# Altium project AFE.PrjPcb
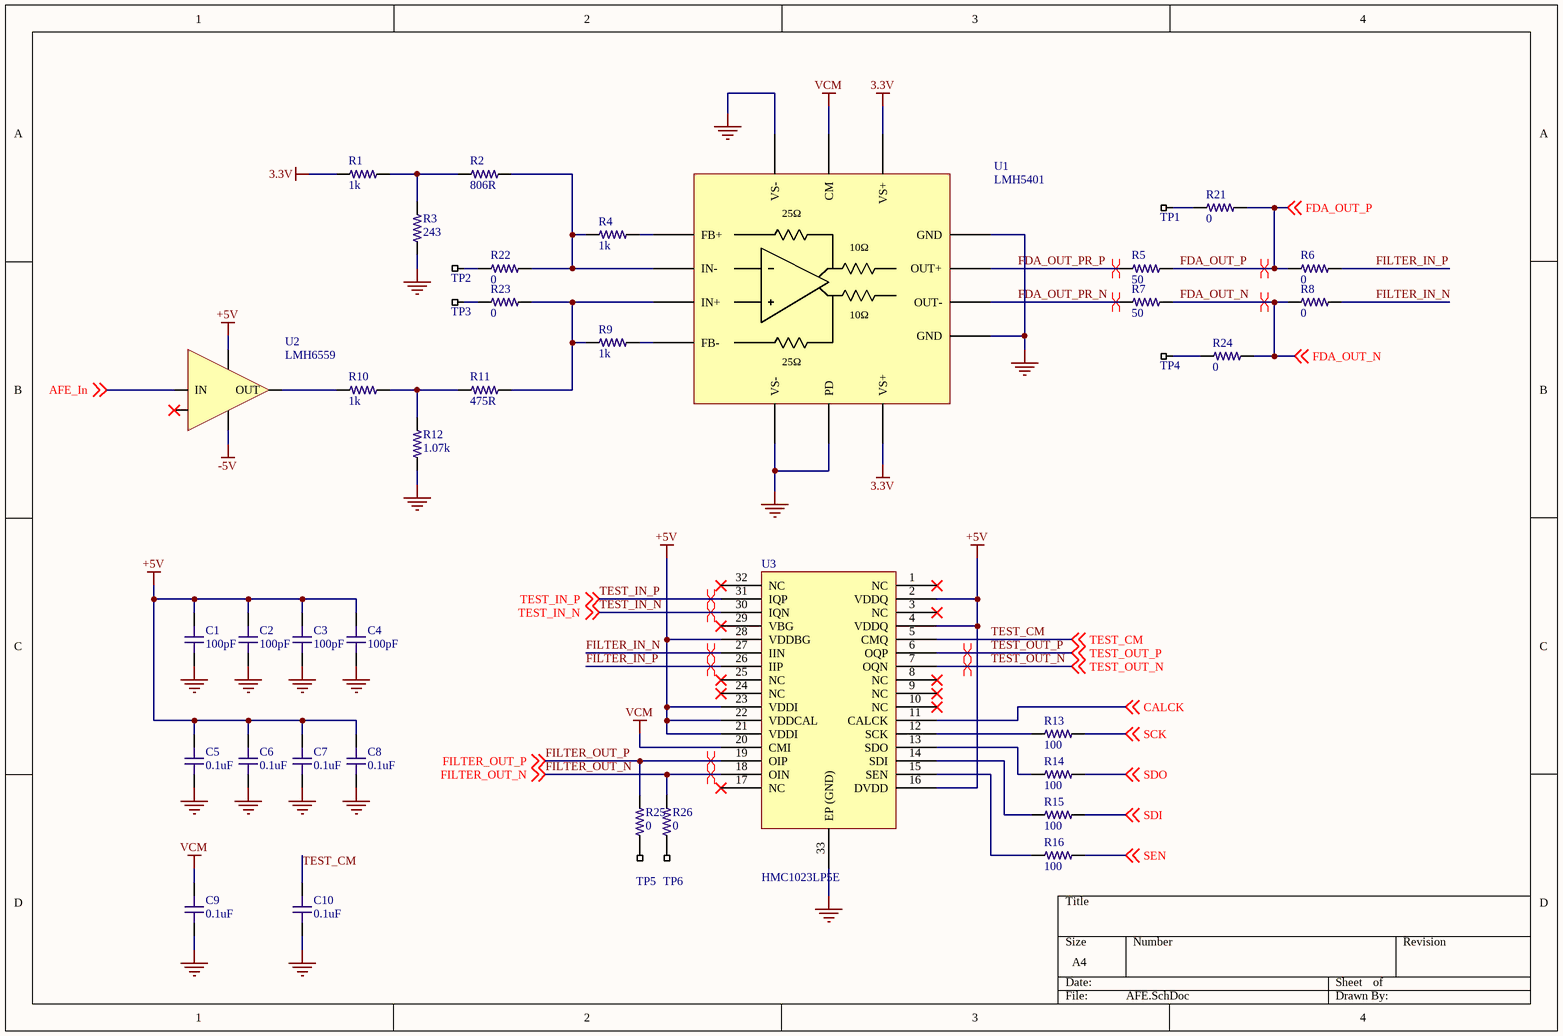
[diagram p0: AFE.SchDoc]
3 sheets, 79 parts. Net scope: global (net labels, ports and power ports of the same name join across sheets).
Board file: AFE.PcbDoc
Sheets:
  AFE.SchDoc
  Connectors.SchDoc
  Power.SchDoc

## Sheet AFE.SchDoc
size A4

### Parts
C1  value 100pF  [C0402-IPC]  (hidden comment: C0402 100pF 50V C0G)
C2  value 100pF  [C0402-IPC]  (hidden comment: C0402 100pF 50V C0G)
C3  value 100pF  [C0402-IPC]  (hidden comment: C0402 100pF 50V C0G)
C4  value 100pF  [C0402-IPC]  (hidden comment: C0402 100pF 50V C0G)
C5  value 0.1uF  [C0402-HIGH-DENSITY]  (hidden comment: GRM155R71H104KE14D)
C6  value 0.1uF  [C0402-HIGH-DENSITY]  (hidden comment: GRM155R71H104KE14D)
C7  value 0.1uF  [C0402-HIGH-DENSITY]  (hidden comment: GRM155R71H104KE14D)
C8  value 0.1uF  [C0402-HIGH-DENSITY]  (hidden comment: GRM155R71H104KE14D)
C9  value 0.1uF  [C0402-HIGH-DENSITY]  (hidden comment: GRM155R71H104KE14D)
C10  value 0.1uF  [C0402-HIGH-DENSITY]  (hidden comment: GRM155R71H104KE14D)
R1  value 1k  [R0402-HIGH-DENSITY]  (hidden comment: R0402 1k 1%)
R2  806R  [R0603-HIGH-DENSITY]
R3  value 243  [R0603-IPC]  (hidden comment: R0603 243 1%)
R4  value 1k  [R0402-HIGH-DENSITY]  (hidden comment: R0402 1k 1%)
R5  value 50  [R0402-HIGH-DENSITY]  (hidden comment: R0402 51 1%)
R6  value 0  [R0402-HIGH-DENSITY]  (hidden comment: R0402 0R)
R7  value 50  [R0402-HIGH-DENSITY]  (hidden comment: R0402 51 1%)
R8  value 0  [R0402-HIGH-DENSITY]  (hidden comment: R0402 0R)
R9  value 1k  [R0402-HIGH-DENSITY]  (hidden comment: R0402 1k 1%)
R10  value 1k  [R0402-HIGH-DENSITY]  (hidden comment: R0402 1k 1%)
R11  475R  [R0402-HIGH-DENSITY]
R12  1.07k  [R0603-HIGH-DENSITY]
R13  value 100  [R0402-HIGH-DENSITY]  (hidden comment: R0402 100R 1%)
R14  value 100  [R0402-HIGH-DENSITY]  (hidden comment: R0402 100R 1%)
R15  value 100  [R0402-HIGH-DENSITY]  (hidden comment: R0402 100R 1%)
R16  value 100  [R0402-HIGH-DENSITY]  (hidden comment: R0402 100R 1%)
R21  value 0  [R0402-HIGH-DENSITY]  (hidden comment: R0402 0R)
R22  value 0  [R0402-HIGH-DENSITY]  (hidden comment: R0402 0R)
R23  value 0  [R0402-HIGH-DENSITY]  (hidden comment: R0402 0R)
R24  value 0  [R0402-HIGH-DENSITY]  (hidden comment: R0402 0R)
R25  value 0  [R0402-HIGH-DENSITY]  (hidden comment: R0402 0R)
R26  value 0  [R0402-HIGH-DENSITY]  (hidden comment: R0402 0R)
TP1  Testpoint_SMT  [TESTPOINT_SMT]  (value not drawn)  (no BOM)
TP2  Testpoint_SMT  [TESTPOINT_SMT]  (value not drawn)  (no BOM)
TP3  Testpoint_SMT  [TESTPOINT_SMT]  (value not drawn)  (no BOM)
TP4  Testpoint_SMT  [TESTPOINT_SMT]  (value not drawn)  (no BOM)
TP5  Testpoint_SMT  [TESTPOINT_SMT]  (value not drawn)  (no BOM)
TP6  Testpoint_SMT  [TESTPOINT_SMT]  (value not drawn)  (no BOM)
U1  LMH5401  [LMH5401]
U2  LMH6559  [LMH6559]
U3  HMC1023LP5E  [HMC1023]

### Nets
3.3V: R1.1 U1.1(VS+) U1.10(VS+)
+5V: C1.2 C2.2 C3.2 C4.2 C5.2 C6.2 C7.2 C8.2 U2.5(V+) U3.2(VDDQ) U3.4(VDDQ) U3.16(DVDD) U3.21(VDDI) U3.22(VDDCAL) U3.23(VDDI) U3.28(VDDBG)
-5V: U2.2(V-)
GND: C1.1 C2.1 C3.1 C4.1 C5.1 C6.1 C7.1 C8.1 C9.1 C10.1 R3.1 R12.1 U1.3(VS-) U1.8(VS-) U1.9(PD) U1.11(GND) U1.14(GND) U3.33(EP_(GND))
VCM: C9.2 U1.2(CM) U3.20(CMI)
AFE_In: U2.4(IN) ; off-sheet AFE_In
CALCK: U3.11(CALCK) ; off-sheet CALCK
FDA_OUT_N: R7.2 R8.1 R24.2 ; off-sheet FDA_OUT_N
FDA_OUT_P: R5.2 R6.1 R21.2 ; off-sheet FDA_OUT_P
FDA_OUT_PR_N: R7.1 U1.12(OUT-)
FDA_OUT_PR_P: R5.1 U1.13(OUT+)
FILTER_IN_N: R8.2 U3.27(IIN)
FILTER_IN_P: R6.2 U3.26(IIP)
FILTER_OUT_N: R26.2 U3.18(OIN) ; off-sheet FILTER_OUT_N  [project net AFE_Out4_N]
FILTER_OUT_P: R25.2 U3.19(OIP) ; off-sheet FILTER_OUT_P  [project net AFE_Out4_P]
SCK: R13.2 ; off-sheet SCK
SDI: R15.2 ; off-sheet SDI
SDO: R14.2 ; off-sheet SDO
SEN: R16.2 ; off-sheet SEN
TEST_CM: C10.2 U3.5(CMQ) ; off-sheet TEST_CM
TEST_IN_N: U3.30(IQN) ; off-sheet TEST_IN_N
TEST_IN_P: U3.31(IQP) ; off-sheet TEST_IN_P
TEST_OUT_N: U3.7(OQN) ; off-sheet TEST_OUT_N
TEST_OUT_P: U3.6(OQP) ; off-sheet TEST_OUT_P
NetR1_2: R1.2 R2.1 R3.2
NetR2_2: R2.2 R4.1 R22.2 U1.5(IN-)
NetR4_2: R4.2 U1.4(FB+)
NetR9_1: R9.1 R11.2 R23.2 U1.6(IN+)
NetR9_2: R9.2 U1.7(FB-)
NetR10_1: R10.1 U2.1(OUT)
NetR10_2: R10.2 R11.1 R12.2
NetR13_1: R13.1 U3.12(SCK)
NetR14_1: R14.1 U3.13(SDO)
NetR15_1: R15.1 U3.14(SDI)
NetR16_1: R16.1 U3.15(SEN)
NetR21_1: R21.1 TP1.1
NetR22_1: R22.1 TP2.1
NetR23_1: R23.1 TP3.1
NetR24_1: R24.1 TP4.1
NetR25_1: R25.1 TP5.1
NetR26_1: R26.1 TP6.1

Not connected (* = marked no-connect by the designer): U2 3(NC)*; U3 1(NC)* 3(NC)* 8(NC)* 9(NC)* 10(NC)* 17(NC)* 24(NC)* 25(NC)* 29(VBG)* 32(NC)*

### Layout directives
differential pair: AFE_Out4_N, AFE_Out4_P, FDA_OUT_N, FDA_OUT_P, FDA_OUT_PR_N, FDA_OUT_PR_P, FILTER_IN_N, FILTER_IN_P, TEST_IN_N, TEST_IN_P, TEST_OUT_N, TEST_OUT_P

### Notes on the sheet
- (in symbol LMH5401) 25Ω; 10Ω

### Library data of the parts
C1-C4 = C0402 100pF 50V C0G: Chip Capacitor, 0402, 100p, 1%, 50V, C0G; Max. Voltage: 50V; EIA Code: C0G; Supplier 1: Digi-Key; Supplier Part Number 1: 490-7753-1-ND
C5-C10 = C0402 0.1uF 50V X7R: Chip Capacitor, 0402, 0.10uF, 50V, X7R; Supplier 1: Digi-Key; Supplier Part Number 1: 490-10700-1-ND
R1 R4 R9 R10 = R0402 1k 1%: Chip Resistor, 0402, 1k ohms, 1%, 1/16 W; Supplier 1: Digi-Key; Supplier Part Number 1: 311-1.00KLRCT-ND
R2 = 806R 0603 0.5% 1/10W: RES 806 OHM 0.5% 1/10W 0603; Manufacturer: Stackpole Electronics; Manufacturer Part Number: RNCF0603DTE806R; Power Rating: 63mW; Supplier 1: Digi-Key; RoHS: Yes; Category: Chip SMD Resistors; Stock 1: 7286; Pricing 1: 1=0.13000, 10=0.11000, 100=0.04300, 1000=0.01800, 2500=0.01650 (USD); Mount: Surface Mount; Case/Package: 0603; Min Operating Temperature: -55°C; Max Operating Temperature: 155°C; Resistance: 806R; Tolerance: 0.5%; Packaging: Tape and Reel; RoHS Compliant: Yes; ComponentLink1URL: https://www.seielect.com/catalog/sei-rncf.pdf?src-supplier=Digi-Key; ComponentLink1Description: https://www.seielect.com/catalog/sei-rncf.pdf?src-supplier=Digi-Key; Supplier Part Number 1: RNCF0603DTE806RCT-ND
R3 = R0603 243 1%: RES SMD 243 OHM 1% 1/10W 0603; Temperature Coefficient: ±100ppm/°C; Tolerance: ±1%; Features: Automotive AEC-Q200; Operating Temperature: -55°C ~ 155°C; Supplier 1: Digi-Key; Supplier Part Number 1: RMCF0603FT243RCT-ND
R5 R7 = R0402 51 1%: Chip Resistor, 0402, 50 ohms, 1%, 1/10 W
R6 R8 R21-R26 = R0402 0R: Chip Resistor, 0402, 0 ohm jumper; Supplier 1: Digi-Key; Supplier Part Number 1: 311-0.0JRCT-ND
R11 = 475R 0402 1% 1/5W: RES SMD 475 OHM 1% 1/5W 0402; Manufacturer: Vishay Dale; Manufacturer Part Number: CRCW0402475RFKEDHP; Max Power Dissipation: 125mW; Temperature Coefficient: 100ppm/°C; Supplier 1: Digi-Key; RoHS: Yes; Category: Chip SMD Resistors; Stock 1: 9500; Pricing 1: 1=0.14000, 10=0.12600, 100=0.04840, 1000=0.02130, 2500=0.01839, 5000=0.01646 (USD); Case/Package: 0402; Contact Plating: Tin; Min Operating Temperature: -55°C; Max Operating Temperature: 155°C; Resistance: 475R; Tolerance: 1%; Package Quantity: 10000; Packaging: Tape and Reel; Resistor Type: Thick Film; Number of Terminations: 2; Features: Automotive AEC-Q200; Series: CRCW-HP; Length: 0.039inch; Width: 0.02inch; Height: 0.016inch; Radiation Hardening: No; Lead Free: Lead Free; RoHS Compliant: Yes; ComponentLink1URL: https://datasheet.ciiva.com/8898/crcwhpe3-8898762.pdf?src-supplier=Avnet; ComponentLink1Description: https://datasheet.ciiva.com/8898/crcwhpe3-8898762.pdf?src-supplier=Avnet; ComponentLink2URL: https://datasheet.ciiva.com/2573/crcwhpe3-2573100.pdf?src-supplier=Digi-Key; ComponentLink2Description: https://datasheet.ciiva.com/2573/crcwhpe3-2573100.pdf?src-supplier=Digi-Key; Supplier Part Number 1: 541-CRCW0402475RFKEDHPCT-ND
R12 = 1.07k 0603 1% 1/10W: RES SMD 1.07K OHM 1% 1/10W 0603; Manufacturer: Stackpole Electronics; Manufacturer Part Number: RMCF0603FT1K07; Resistance: 1.07kR; Max Power Dissipation: 100mW; Temperature Coefficient: 100ppm/°C; Supplier 1: Digi-Key; RoHS: Yes; Category: Chip SMD Resistors; Stock 1: 16341; Pricing 1: 1=0.10000, 10=0.01600, 100=0.00650, 1000=0.00292, 2500=0.00253 (USD); Mount: Surface Mount; Case/Package: 0603; Case Code (Metric): 1608; Case Code (Imperial): 0603; Contact Plating: Tin,Matte; Min Operating Temperature: -55°C; Max Operating Temperature: 155°C; Packaging: Tape and Reel; Tolerance: 1%; Resistor Type: Thick Film; Number of Terminations: 2; Features: Automotive AEC-Q200; Series: RMCF; Length: 0.061inch; Width: 0.031inch; Height: 0.022inch; Radiation Hardening: No; Lead Free: Lead Free; RoHS Compliant: Yes; ComponentLink1URL: https://www.seielect.com/catalog/SEI-RMCF_RMCP.pdf?src-supplier=Avnet; ComponentLink1Description: https://www.seielect.com/catalog/SEI-RMCF_RMCP.pdf?src-supplier=Avnet; ComponentLink2URL: https://www.seielect.com/Catalog/SEI-RMCF_RMCP.pdf?src-supplier=Digi-Key; ComponentLink2Description: https://www.seielect.com/Catalog/SEI-RMCF_RMCP.pdf?src-supplier=Digi-Key; ComponentLink3URL: https://www.seielect.com/catalog/SEI-Packaging.pdf?src-supplier=Digi-Key; ComponentLink3Description: https://www.seielect.com/catalog/SEI-Packaging.pdf?src-supplier=Digi-Key; Supplier Part Number 1: RMCF0603FT1K07CT-ND
R13-R16 = R0402 100R 1%: Chip Resistor, 0402, 100 ohms, 1%, 1/16 W; Supplier 1: Digi-Key; Supplier Part Number 1: 311-100LRCT-ND
TP1-TP6 = Testpoint_SMT: SMT Test Point
U1 = LMH5401: TEXAS INSTRUMENTS - LMH5401IRMST - DIFF AMP, 6.2GHZ, 17.5KV/US, UQFN-14; Min Supply Voltage: 3.15V; Max Supply Voltage: 5.25V; Min Dual Supply Voltage: 1.575V; Max Dual Supply Voltage: 2.625V; Number of Circuits: 1; Slew Rate: 17500V/µs; Gain Bandwidth Product: 8GHz; -3db Bandwidth: 1.2GHz; Operating Supply Current: 55mA; Output Current per Channel: 50mA; Frequency: 2GHz; Gain: 6dB; Operating Supply Voltage: 5V; Supplier 1: Digi-Key; Manufacturer: Texas Instruments; Manufacturer Part Number: LMH5401IRMST; RoHS: Yes; Category: Amplifiers - Op Amps, Buffer, Instrumentation; Stock 1: 1716; Pricing 1: 1=17.26000, 10=15.86500, 25=15.20760, 100=12.74150 (USD); Mount: Surface Mount; Number of Pins: 14; Weight: 0.000353oz; Min Operating Temperature: -40°C; Max Operating Temperature: 85°C; Packaging: Tape and Reel; Number of Amplifiers: 1; Bandwidth: 8GHz; Number of Channels: 1; Package Quantity: 250; REACH SVHC: No SVHC; Lead Free: Lead Free; RoHS Compliant: Yes; ComponentLink1URL: https://datasheet.ciiva.com/48505/lmh5401-48505045.pdf?src-supplier=Avnet; ComponentLink1Description: https://datasheet.ciiva.com/48505/lmh5401-48505045.pdf?src-supplier=Avnet; Supplier Part Number 1: 296-38513-1-ND
U2 = LMH6559: OP Amp Buffer Single GP 10V 5-Pin SOT-23 T/R; Manufacturer: TI National Semiconductor; Manufacturer Part Number: LMH6559MF/NOPB; Min Supply Voltage: 3V; Voltage Gain: 59.98dB; Output Current: 75mA; Number of Channels: 1; Slew Rate: 4580V/µs; Nominal Supply Current: 10mA; Operating Supply Voltage: 5V; Input Bias Current: 3uA; Input Offset Voltage (Vos): 3mV; Output Current per Channel: 74mA; Min Dual Supply Voltage: 1.5V; Power Supply Rejection Ratio (PSRR): 44dB; -3db Bandwidth: 1.75GHz; Supplier 1: Digi-Key; RoHS: No; Category: Amplifiers - Op Amps, Buffer, Instrumentation; Stock 1: 2784; Pricing 1: 1=2.89000, 10=2.59800, 25=2.45640, 100=2.01980, 250=1.81240, 500=1.74688 (USD); Mount: Surface Mount; Case/Package: SOT-23; Number of Pins: 5; Min Operating Temperature: -40°C; Max Operating Temperature: 85°C; Max Supply Voltage: 10V; Packaging: Tape and Reel; Package Quantity: 1000; Number of Circuits: 1; Supply Current: 10mA; Amplifier Type: BUFFER; Number of Elements: 1; Series: -; Number of Amplifiers: 1; Bandwidth: 1.75GHz; Termination: SMD/SMT; Length: 2.92mm; Width: 1.6mm; Height: 1.02mm; Radiation Hardening: No; Lead Free: Lead Free; REACH SVHC: No SVHC; ComponentLink1URL: https://datasheet.ciiva.com/15130/getdatasheetpartid-68437-15130143.pdf?src-supplier=Verical; ComponentLink1Description: https://datasheet.ciiva.com/15130/getdatasheetpartid-68437-15130143.pdf?src-supplier=Verical; ComponentLink2URL: https://datasheet.ciiva.com/2975/lmh6559-2975204.pdf?src-supplier=Avnet; ComponentLink2Description: https://datasheet.ciiva.com/2975/lmh6559-2975204.pdf?src-supplier=Avnet; ComponentLink3URL: https://datasheet.ciiva.com/2975/lmh6559-2975205.pdf?src-supplier=Avnet; ComponentLink3Description: https://datasheet.ciiva.com/2975/lmh6559-2975205.pdf?src-supplier=Avnet; ComponentLink4URL: https://datasheet.ciiva.com/6630/lmh6559-6630632.pdf?src-supplier=Digi-Key; ComponentLink4Description: https://datasheet.ciiva.com/6630/lmh6559-6630632.pdf?src-supplier=Digi-Key; ComponentLink5URL: https://datasheet.ciiva.com/6630/lmh6559-6630633.pdf?src-supplier=Digi-Key; ComponentLink5Description: https://datasheet.ciiva.com/6630/lmh6559-6630633.pdf?src-supplier=Digi-Key; ComponentLink6URL: https://datasheet.ciiva.com/6630/lmh6559-6630634.pdf?src-supplier=Digi-Key; ComponentLink6Description: https://datasheet.ciiva.com/6630/lmh6559-6630634.pdf?src-supplier=Digi-Key; ComponentLink7URL: https://datasheet.ciiva.com/4756/lmh6559-4756997.pdf?src-supplier=Mouser; ComponentLink7Description: https://datasheet.ciiva.com/4756/lmh6559-4756997.pdf?src-supplier=Mouser; ComponentLink8URL: https://datasheet.ciiva.com/14094/lmh6559-eng-tds-14094141.pdf?src-supplier=Distrelec; ComponentLink8Description: https://datasheet.ciiva.com/14094/lmh6559-eng-tds-14094141.pdf?src-supplier=Distrelec; ComponentLink9URL: https://datasheet.ciiva.com/26223/lmh6559-26223561.pdf?src-supplier=Avnet+Europe; ComponentLink9Description: https://datasheet.ciiva.com/26223/lmh6559-26223561.pdf?src-supplier=Avnet+Europe; Supplier Part Number 1: LMH6559MF/NOPBCT-ND
U3 = HMC1023LP5E: Active Filter Dual Low Pass Filter 6th Order 72MHz 32-Pin QFN Bulk; Manufacturer: Analog Devices; Operating Supply Voltage: 5V; Min Supply Voltage: 4.75V; Max Supply Voltage: 5.25V; Frequency: 100MHz; Number of Channels: 2; Supplier 1: Digi-Key; Manufacturer Part Number: HMC1023LP5E; RoHS: Yes; Category: Integrated Circuits (ICs); Stock 1: 38; Pricing 1: 1=25.14000, 10=24.35000, 25=23.56480, 50=22.77960, 100=21.99400, 250=20.89432 (USD); Mount: Surface Mount; Case/Package: QFN; Number of Pins: 32; Weight: 0.006653oz; Contact Plating: Tin,Matte; Min Operating Temperature: -40°C; Max Operating Temperature: 85°C; Packaging: Cut Tape; Package Quantity: 1; Bandwidth: 72MHz; Number of Circuits: 2; Max Frequency: 72MHz; Length: 0.197inch; Width: 0.197inch; Height: 0.039inch; REACH SVHC: Unknown; Lead Free: Contains Lead; RoHS Compliant: Yes; ComponentLink1URL: https://datasheet.ciiva.com/29361/hmc1023lp5-29361744.pdf?src-supplier=Digi-Key; ComponentLink1Description: https://datasheet.ciiva.com/29361/hmc1023lp5-29361744.pdf?src-supplier=Digi-Key; Supplier Part Number 1: 1127-1662-ND

## Sheet Connectors.SchDoc
size A4
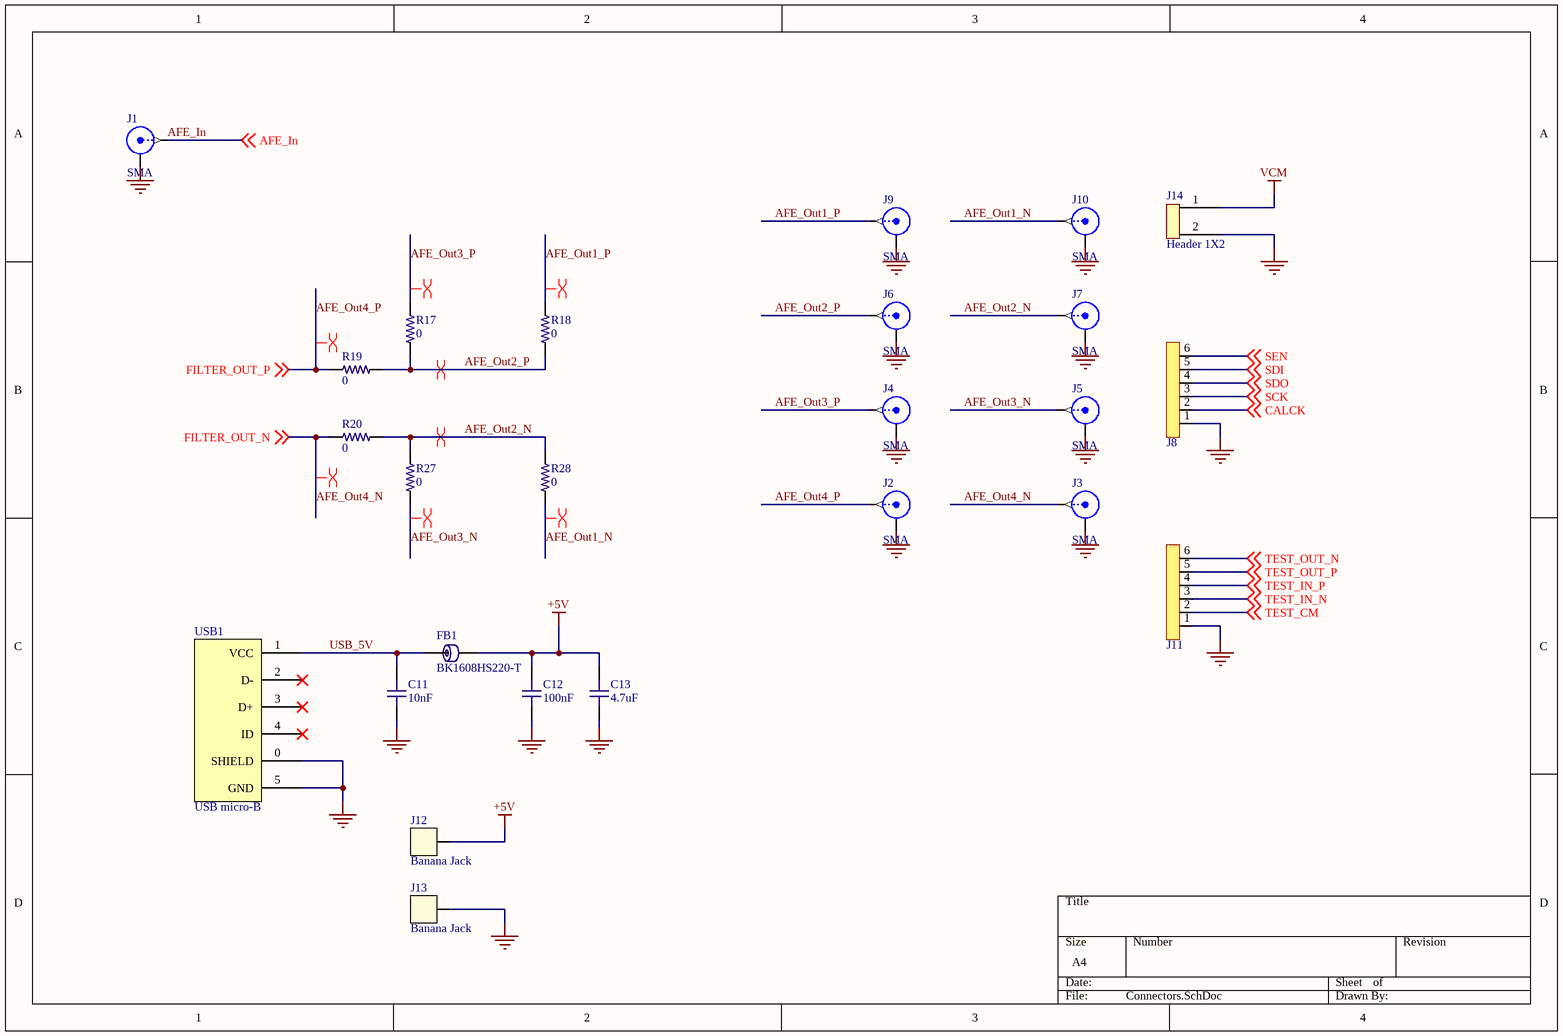
[diagram p1: Connectors.SchDoc]

### Parts
C11  value 10nF  [C0402-IPC]  (hidden comment: C0402 10nF 16V X7R)
C12  value 100nF  [C0402-IPC]  (hidden comment: C0402 100nF 16V X7R)
C13  value 4.7uF  [C0603-HIGH-DENSITY]  (hidden comment: 4.7uF, 25V, X5R, 0603)
FB1  BK1608HS220-T  [L0603]
J1  SMA  [SMA Edge Launch (Horizontal)]
J2  SMA  [SMA Edge Launch (Horizontal)]
J3  SMA  [SMA Edge Launch (Horizontal)]
J4  SMA  [SMA Edge Launch (Horizontal)]
J5  SMA  [SMA Edge Launch (Horizontal)]
J6  SMA  [SMA Edge Launch (Horizontal)]
J7  SMA  [SMA Edge Launch (Horizontal)]
J8  100 mil hdr 6 pos  [100MIL HDR 6 POS]  (value not drawn)
J9  SMA  [SMA Edge Launch (Horizontal)]
J10  SMA  [SMA Edge Launch (Horizontal)]
J11  100 mil hdr 6 pos  [100MIL HDR 6 POS]  (value not drawn)
J12  Banana Jack  [Banana Jack]
J13  Banana Jack  [Banana Jack]
J14  Header 1X2  [Header 1x2 TH Pitch 2.54mm]
R17  value 0  [R0603-IPC]  (hidden comment: R0603 0)
R18  value 0  [R0603-IPC]  (hidden comment: R0603 0)
R19  value 0  [R0603-IPC]  (hidden comment: R0603 0)
R20  value 0  [R0603-IPC]  (hidden comment: R0603 0)
R27  value 0  [R0603-IPC]  (hidden comment: R0603 0)
R28  value 0  [R0603-IPC]  (hidden comment: R0603 0)
USB1  USB micro-B  [USB-MicroB]

### Nets
+5V: C12.2 C13.2 FB1.2 J12.1
GND: C11.1 C12.1 C13.1 J1.2(Y) J2.2(Y) J3.2(Y) J4.2(Y) J5.2(Y) J6.2(Y) J7.2(Y) J8.1 J9.2(Y) J10.2(Y) J11.1 J13.1 J14.2 USB1.0(SHIELD) USB1.5(GND)
VCM: J14.1
AFE_In: J1.1(X) ; off-sheet AFE_In
AFE_Out1_N: J10.1(X) R28.1
AFE_Out1_P: J9.1(X) R18.2
AFE_Out2_N: J7.1(X) R20.2 R27.2 R28.2
AFE_Out2_P: J6.1(X) R17.1 R18.1 R19.2
AFE_Out3_N: J5.1(X) R27.1
AFE_Out3_P: J4.1(X) R17.2
AFE_Out4_N: J3.1(X) R20.1 ; off-sheet FILTER_OUT_N  [also labelled FILTER_OUT_N]
AFE_Out4_P: J2.1(X) R19.1 ; off-sheet FILTER_OUT_P  [also labelled FILTER_OUT_P]
CALCK: J8.2 ; off-sheet CALCK
SCK: J8.3 ; off-sheet SCK
SDI: J8.5 ; off-sheet SDI
SDO: J8.4 ; off-sheet SDO
SEN: J8.6 ; off-sheet SEN
TEST_CM: J11.2 ; off-sheet TEST_CM
TEST_IN_N: J11.3 ; off-sheet TEST_IN_N
TEST_IN_P: J11.4 ; off-sheet TEST_IN_P
TEST_OUT_N: J11.6 ; off-sheet TEST_OUT_N
TEST_OUT_P: J11.5 ; off-sheet TEST_OUT_P
USB_5V: C11.2 FB1.1 USB1.1(VCC)

Not connected (* = marked no-connect by the designer): USB1 2(D-)* 3(D+)* 4(ID)*

### Layout directives
differential pair: AFE_Out1_N, AFE_Out1_P, AFE_Out2_N, AFE_Out2_P, AFE_Out3_N, AFE_Out3_P, AFE_Out4_N, AFE_Out4_P

### Library data of the parts
C11 = C0402 10nF 16V X7R: Chip Capacitor, 0402, 10nF, 16V, X7R; EIA Code: X5R; Max. Voltage: 16V; Supplier 1: Digi-Key; Supplier Part Number 1: 490-1313-1-ND
C12 = C0402 100nF 16V X7R: Chip Capacitor, 0402, 100nF, 16V, X7R; EIA Code: X5R; Max. Voltage: 16V; Supplier 1: Digi-Key; Supplier Part Number 1: 490-6328-1-ND
C13 = C0603 4.7uF 25V X5R: Chip Capacitor, 0603, 4.7uF, 25V, X5R; EIA Code: X5R; Max. Voltage: 25V; Supplier 1: Digi-Key; Supplier 2: Mouser; Supplier 3: LCSC; Supplier Part Number 1: 490-7203-1-ND; Supplier Part Number 2: 81-GRM188R61E475KE1D; Supplier Part Number 3: C90057
FB1 = BK1608HS220-T: Ferrite Beads Multi-Layer 22Ohm 25% 100MHz 1.5A 0.05Ohm DCR 0603 T/R; Manufacturer: Taiyo Yuden; Impedance: 22R; DC Resistance (DCR): 50mR; Number of Lines: 1; Shielding: Shielded; Supplier 1: Digi-Key; Manufacturer Part Number: BK1608HS220-T; RoHS: Yes; Category: Ferrite Beads and Chips; Stock 1: 23669; Pricing 1: 1=0.10000, 10=0.07200, 25=0.06560, 50=0.05900, 100=0.04320, 250=0.03144, 500=0.02882, 1000=0.02489 (USD); Mount: Surface Mount; Case/Package: 0603; Number of Pins: 2; Core Material: Ferrite; Case Code (Metric): 1608; Case Code (Imperial): 0603; Min Operating Temperature: -55°C; Max Operating Temperature: 125°C; Package Quantity: 1; Packaging: Tape and Reel; Tolerance: 25%; Max DC Current: 1.5A; Termination: SMD/SMT; Test Frequency: 100MHz; Resistance: 50mR; Max Current Rating: 1.5A; Series: BK; Frequency: 100MHz; Length: 0.063inch; Width: 0.031inch; Height: 0.037inch; Depth: 0.95mm; RoHS Compliant: Yes; REACH SVHC: No SVHC; Lead Free: Lead Free; Halogen Free: Halogen Free; ComponentLink1URL: https://datasheet.ciiva.com/1011/bk1608hs220-t-ss-1011861.pdf?src-supplier=Digi-Key; ComponentLink1Description: https://datasheet.ciiva.com/1011/bk1608hs220-t-ss-1011861.pdf?src-supplier=Digi-Key; ComponentLink2URL: https://datasheet.ciiva.com/1011/mlci07-e-1011862.pdf?src-supplier=Digi-Key; ComponentLink2Description: https://datasheet.ciiva.com/1011/mlci07-e-1011862.pdf?src-supplier=Digi-Key; ComponentLink3URL: https://datasheet.ciiva.com/1011/mlci07-e-1011863.pdf?src-supplier=Digi-Key; ComponentLink3Description: https://datasheet.ciiva.com/1011/mlci07-e-1011863.pdf?src-supplier=Digi-Key; ComponentLink4URL: https://datasheet.ciiva.com/5821/mlci07-e-5821271.pdf?src-supplier=Farnell; ComponentLink4Description: https://datasheet.ciiva.com/5821/mlci07-e-5821271.pdf?src-supplier=Farnell; ComponentLink5URL: https://datasheet.ciiva.com/7620/1734576-7620028.pdf?src-supplier=Element14; ComponentLink5Description: https://datasheet.ciiva.com/7620/1734576-7620028.pdf?src-supplier=Element14; Supplier Part Number 1: 587-1869-1-ND
J1-J7 J9 J10 = SMA: SMA Connector; Supplier 1: Digi-Key; Supplier Part Number 1: A97594-ND
J8 J11 = 100 mil hdr 6 pos: Header, 100 mil, 6pos, tin; Supplier 1: Digi-Key; Supplier Part Number 1: A31116-ND
J12 J13 = Banana Jack: JACK NON-INSULATED .350"; Supplier 1: Digi-Key; Supplier Part Number 1: 36-575-8-ND
R17-R20 R27 R28 = R0603 0: RES SMD 0 OHM JUMPER 1/10W 0603; Supplier 1: Digi-Key; Supplier Part Number 1: RMCF0603ZT0R00CT-ND
USB1 = USB micro-B: CONN RCPT USB TYPE B 3A; Manufacturer Part Number: 629105150521; Manufacturer: Wurth Electronics Inc.; Supplier 1: Digi-Key; Supplier Part Number 1: 609-4616-1-ND

## Sheet Power.SchDoc
size A4
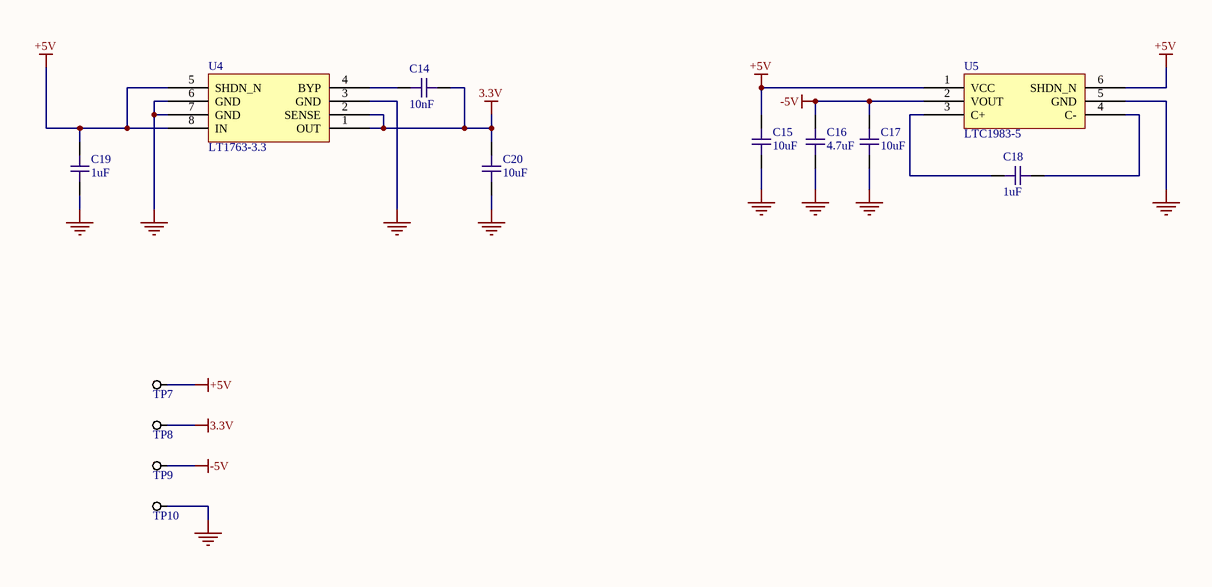
[diagram p2: Power.SchDoc]

### Parts
C14  value 10nF  [C0402-IPC]  (hidden comment: C0402 10nF 16V X7R)
C15  value 10uF  [C0402-HIGH-DENSITY]  (hidden comment: C0402 10uF 10V)
C16  value 4.7uF  [C0603-HIGH-DENSITY]  (hidden comment: 4.7uF, 25V, X5R, 0603)
C17  value 10uF  [C0402-HIGH-DENSITY]  (hidden comment: C0402 10uF 10V)
C18  1uF  [C0603-HIGH-DENSITY]
C19  1uF  [C0603-HIGH-DENSITY]
C20  value 10uF  [C0402-HIGH-DENSITY]  (hidden comment: C0402 10uF 10V)
TP7  Testpoint_TH  [Testpoint_TH]  (value not drawn)
TP8  Testpoint_TH  [Testpoint_TH]  (value not drawn)
TP9  Testpoint_TH  [Testpoint_TH]  (value not drawn)
TP10  Testpoint_TH  [Testpoint_TH]  (value not drawn)
U4  LT1763-3.3  [LT1763-3.3]
U5  LTC1983-5  [LTC1983-5]

### Nets
3.3V: C14.2 C20.2 TP8.1 U4.1(OUT) U4.2(SENSE)
+5V: C15.2 C19.2 TP7.1 U4.5(SHDN_N) U4.8(IN) U5.1(VCC) U5.6(SHDN_N)
-5V: C16.2 C17.2 TP9.1 U5.2(VOUT)
GND: C15.1 C16.1 C17.1 C19.1 C20.1 TP10.1 U4.3(GND) U4.6(GND) U4.7(GND) U5.5(GND)
NetC14_1: C14.1 U4.4(BYP)
NetC18_1: C18.1 U5.3(C+)
NetC18_2: C18.2 U5.4(C-)

### Library data of the parts
C14 = C0402 10nF 16V X7R: as C11 on sheet Connectors; Max. Voltage: 16V; Supplier 1: Digi-Key; Supplier Part Number 1: 490-1313-1-ND
C15 C17 C20 = C0402 10uF 10V: Chip Capacitor, 0402, 10uF, 10V, X5R; EIA Code: X5R; Max. Voltage: 10V; Supplier 1: Digi-Key; Supplier Part Number 1: 1276-1450-2-ND
C16 = C0603 4.7uF 25V X5R: Chip Capacitor, 0603, 4.7uF, 25V, X5R; EIA Code: X5R; Max. Voltage: 25V; Supplier 1: Digi-Key; Supplier 2: Mouser; Supplier 3: LCSC; Supplier Part Number 1: 490-7203-1-ND; Supplier Part Number 2: 81-GRM188R61E475KE1D; Supplier Part Number 3: C90057
C18 C19 = 1uF 0603 35V X5R: CAP CER 1UF 35V X5R 0603; Manufacturer: Taiyo Yuden; Manufacturer Part Number: GMK107BJ105MAHT; Tolerance: 20%; Supplier 1: Digi-Key; RoHS: Yes; Category: Ceramic Capacitors; Stock 1: 1779; Pricing 1: 1=0.19000, 10=0.13300, 50=0.07960, 100=0.06730, 500=0.04604, 1000=0.04073 (USD); Mount: Surface Mount; Case/Package: 0603; Min Operating Temperature: -55°C; Max Operating Temperature: 85°C; Packaging: Tape and Reel; Capacitance: 1uF; Voltage Rating: 35V; Ratings: AEC-Q200; RoHS Compliant: Yes; ComponentLink1URL: http://ds.yuden.co.jp/TYCOMPAS/ut/detail.do?productNo=GMK107BJ105MAHT&amp;fileName=GMK107BJ105MAHT_SS&amp;mode=specSheetDownload&src-supplier=Digi-Key; ComponentLink1Description: http://ds.yuden.co.jp/TYCOMPAS/ut/detail.do?productNo=GMK107BJ105MAHT&amp;fileName=GMK107BJ105MAHT_SS&amp;mode=specSheetDownload&src-supplier=Digi-Key; Supplier Part Number 1: 587-6315-1-ND
TP7-TP10 = Testpoint_TH: Through-hole testpoint hook
U4 = LT1763-3.3: LDO Regulator Pos 3.3V 0.5A Automotive 8-Pin SOIC N Tube; Manufacturer: Analog Devices / Linear Technology; Manufacturer Part Number: LT1763CS8-3.3#PBF; Output Current: 500mA; Dropout Voltage: 300mV; Number of Outputs: 1; Max Input Voltage: 20V; Min Input Voltage: 1.8V; Min Current Limit: 520mA; Polarity: Positive; Quiescent Current: 30uA; Reference Voltage: 1.22V; Power Supply Rejection Ratio (PSRR): 65dB; Output Type: Fixed; Supplier 1: Digi-Key; RoHS: Yes; Category: Voltage Regulators - Linear; Stock 1: 7556; Pricing 1: 1=5.20000, 10=4.66700, 25=4.41240, 100=3.82400, 250=3.62784, 500=3.25526, 1000=2.77500 (USD); Case/Package: SOIC; Number of Pins: 8; Min Operating Temperature: -40°C; Max Operating Temperature: 125°C; Package Quantity: 100; Packaging: Rail/Tube; Max Output Current: 500mA; Nominal Output Voltage: 3.3V; Output Voltage: 3.3V; Number of Regulators: 1; Operating Supply Current: 30uA; Series: -; Length: 5mm; Width: 3.988mm; Height: 1.5mm; REACH SVHC: No SVHC; Lead Free: Lead Free; RoHS Compliant: Yes; ComponentLink1URL: https://datasheet.ciiva.com/14150/ef640087-e-14150152.pdf?src-supplier=Distrelec; ComponentLink1Description: https://datasheet.ciiva.com/14150/ef640087-e-14150152.pdf?src-supplier=Distrelec; ComponentLink2URL: https://datasheet.ciiva.com/2041/3903-2041558.pdf?src-supplier=Digi-Key; ComponentLink2Description: https://datasheet.ciiva.com/2041/3903-2041558.pdf?src-supplier=Digi-Key; ComponentLink3URL: https://datasheet.ciiva.com/5698/1599494-5698296.pdf?src-supplier=Farnell; ComponentLink3Description: https://datasheet.ciiva.com/5698/1599494-5698296.pdf?src-supplier=Farnell; Supplier Part Number 1: LT1763CS8-3.3#PBF-ND
U5 = LTC1983-5: IC REG SWTCHD CAP INV -5V SOT23; Manufacturer: Analog Devices / Linear Technology; Manufacturer Part Number: LTC1983ES6-5#TRPBF; Max Supply Voltage: 5.5V; Min Supply Voltage: 2.3V; Output Current: 100mA; Output Voltage: -5.5V; Number of Outputs: 1; Min Input Voltage: 5V; Switching Frequency: 900kHz; Synchronous Rectifier: No; Operating Supply Current: 25uA; Output Type: Fixed; Supplier 1: Digi-Key; RoHS: Yes; Category: Voltage Regulators - Switching; Stock 1: 5862; Pricing 1: 1=4.83000, 10=4.33900, 25=4.10240, 100=3.37290, 250=3.02652, 500=2.91712, 1000=2.42486 (USD); Case/Package: SOT-23-6; Number of Pins: 6; Min Operating Temperature: -40°C; Max Operating Temperature: 85°C; Package Quantity: 2500; Max Output Current: 100mA; Packaging: Tape and Reel; Max Input Voltage: 5.5V; Series: -; Radiation Hardening: No; Lead Free: Lead Free; RoHS Compliant: Yes; ComponentLink1URL: https://datasheet.ciiva.com/15114/getdatasheetpartid-371063-15114160.pdf?src-supplier=Verical; ComponentLink1Description: https://datasheet.ciiva.com/15114/getdatasheetpartid-371063-15114160.pdf?src-supplier=Verical; ComponentLink2URL: https://datasheet.ciiva.com/26898/ltc1983es6-5-trpbf-26898763.pdf?src-supplier=IIIC; ComponentLink2Description: https://datasheet.ciiva.com/26898/ltc1983es6-5-trpbf-26898763.pdf?src-supplier=IIIC; ComponentLink3URL: https://datasheet.ciiva.com/2030/2135-2030773.pdf?src-supplier=Digi-Key; ComponentLink3Description: https://datasheet.ciiva.com/2030/2135-2030773.pdf?src-supplier=Digi-Key; Supplier Part Number 1: LTC1983ES6-5#TRPBFCT-ND

## Nets that join several sheets
3.3V: AFE (R1.1 U1.1 U1.10), Power (5 pins)
+5V: AFE (16 pins), Connectors (C12.2 C13.2 FB1.2 J12.1), Power (7 pins)
-5V: AFE (U2.2), Power (C16.2 C17.2 TP9.1 U5.2)
GND: AFE (18 pins), Connectors (18 pins), Power (10 pins)
VCM: AFE (C9.2 U1.2 U3.20), Connectors (J14.1)
AFE_In: AFE (U2.4), Connectors (J1.1)
AFE_Out4_N: AFE (R26.2 U3.18), Connectors (J3.1 R20.1)
AFE_Out4_P: AFE (R25.2 U3.19), Connectors (J2.1 R19.1)
CALCK: AFE (U3.11), Connectors (J8.2)
SCK: AFE (R13.2), Connectors (J8.3)
SDI: AFE (R15.2), Connectors (J8.5)
SDO: AFE (R14.2), Connectors (J8.4)
SEN: AFE (R16.2), Connectors (J8.6)
TEST_CM: AFE (C10.2 U3.5), Connectors (J11.2)
TEST_IN_N: AFE (U3.30), Connectors (J11.3)
TEST_IN_P: AFE (U3.31), Connectors (J11.4)
TEST_OUT_N: AFE (U3.7), Connectors (J11.6)
TEST_OUT_P: AFE (U3.6), Connectors (J11.5)